# Altium project USB_Isolator.PrjPcb
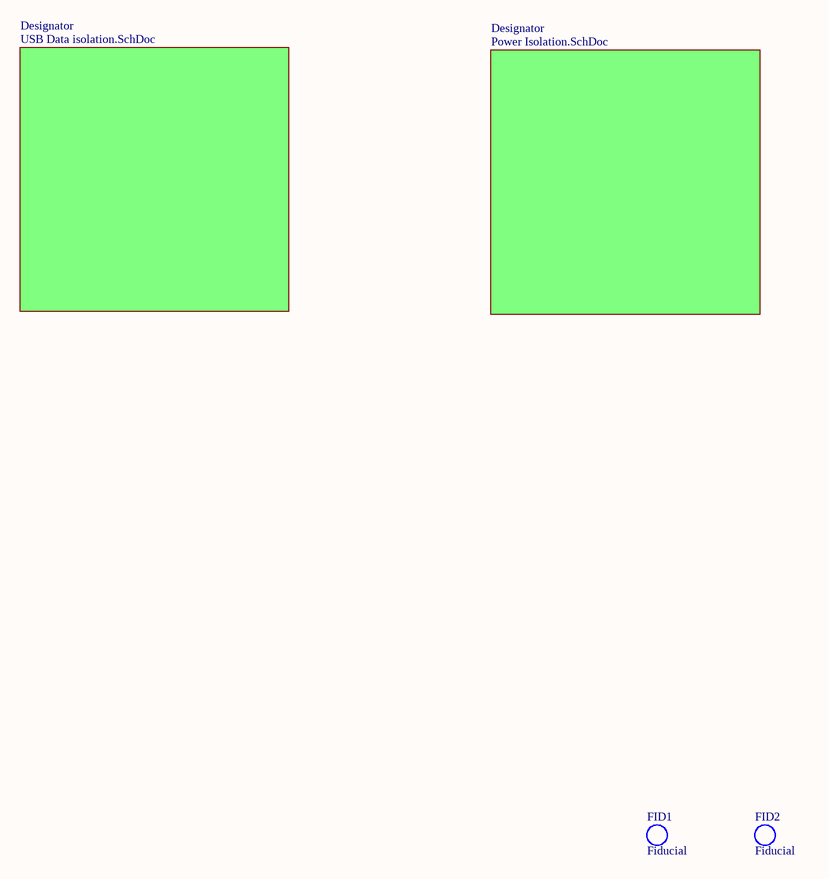
[diagram p0: USB_Isolator.SchDoc]
3 sheets, 26 parts. Net scope: global (net labels, ports and power ports of the same name join across sheets).
Board files: USB Isolator Board.PcbDoc, USB Isolator PNL.PcbDoc
Sheets:
  USB_Isolator.SchDoc
    Designator = USB Data isolation.SchDoc
    Designator = Power Isolation.SchDoc

## Sheet USB_Isolator.SchDoc: USB Isolator by Harsha
size 431 x 279 mm; DrawnBy: Harsha Sandirigama; Engineer: Harsha Sandirigama; DocumentNumber: 1.0; Revision: 1.0; SheetNumber: 1; SheetTotal: 3; Project: USB Isolator; ENG_APP_DATE: --/--/--; DSN_APP_DATE: --/--/--; CHK_APP_DATE: --/--/--

### Parts
FID1  Fiducial  [FID_0.5mm]  (no BOM)
FID2  Fiducial  [FID_0.5mm]  (no BOM)

### Sub-sheets
Designator = USB Data isolation.SchDoc: no entries
Designator = Power Isolation.SchDoc: no entries

### Notes on the sheet
- DWG. NO.
- REV.
- SHT.
- THIS DOCUMENT AND THE DATA DISCLOSED HEREIN OR HEREWITH IS THE PROPERTY OF ALTIUM LIMITED AND MAY BE FREELY DISTRIBUTED IN WHOLE. NO RIGHTS ARE RESERVED OR EXPRESS OR IMPLIED WARANTEE GIVEN.
- REVISION
- DESCRIPTION
- DATE
- APPROVED
- ENG:
- APPROVALS
- PROJECT
- DSN:
- CHK:
- REFERENCE DOCUMENTS
- PROJECT REVISION:
- TITLE
- DOCUMENT REVISION:
- DESIGN ITEM:
- BOM:
- FAB DWG:
- PCB DWG:
- ASSY DWG:
- SCALE:
- SIZE
- B
- CAGE CODE
- FILE NAME
- DWG NO.
- SHEET
- OF
- REV

### Library data of the parts
FID1 FID2 = Fiducial_0.5mm

## Sheet USB Data isolation.SchDoc: USB Data Isolation
size 431 x 279 mm; DrawnBy: Harsha Sandirigama; Engineer: Harsha Sandirigama; Revision: -; SheetNumber: 3; SheetTotal: 3; Project: USB Isolator; ENG_APP_DATE: --/--/--; DSN_APP_DATE: --/--/--; CHK_APP_DATE: --/--/--
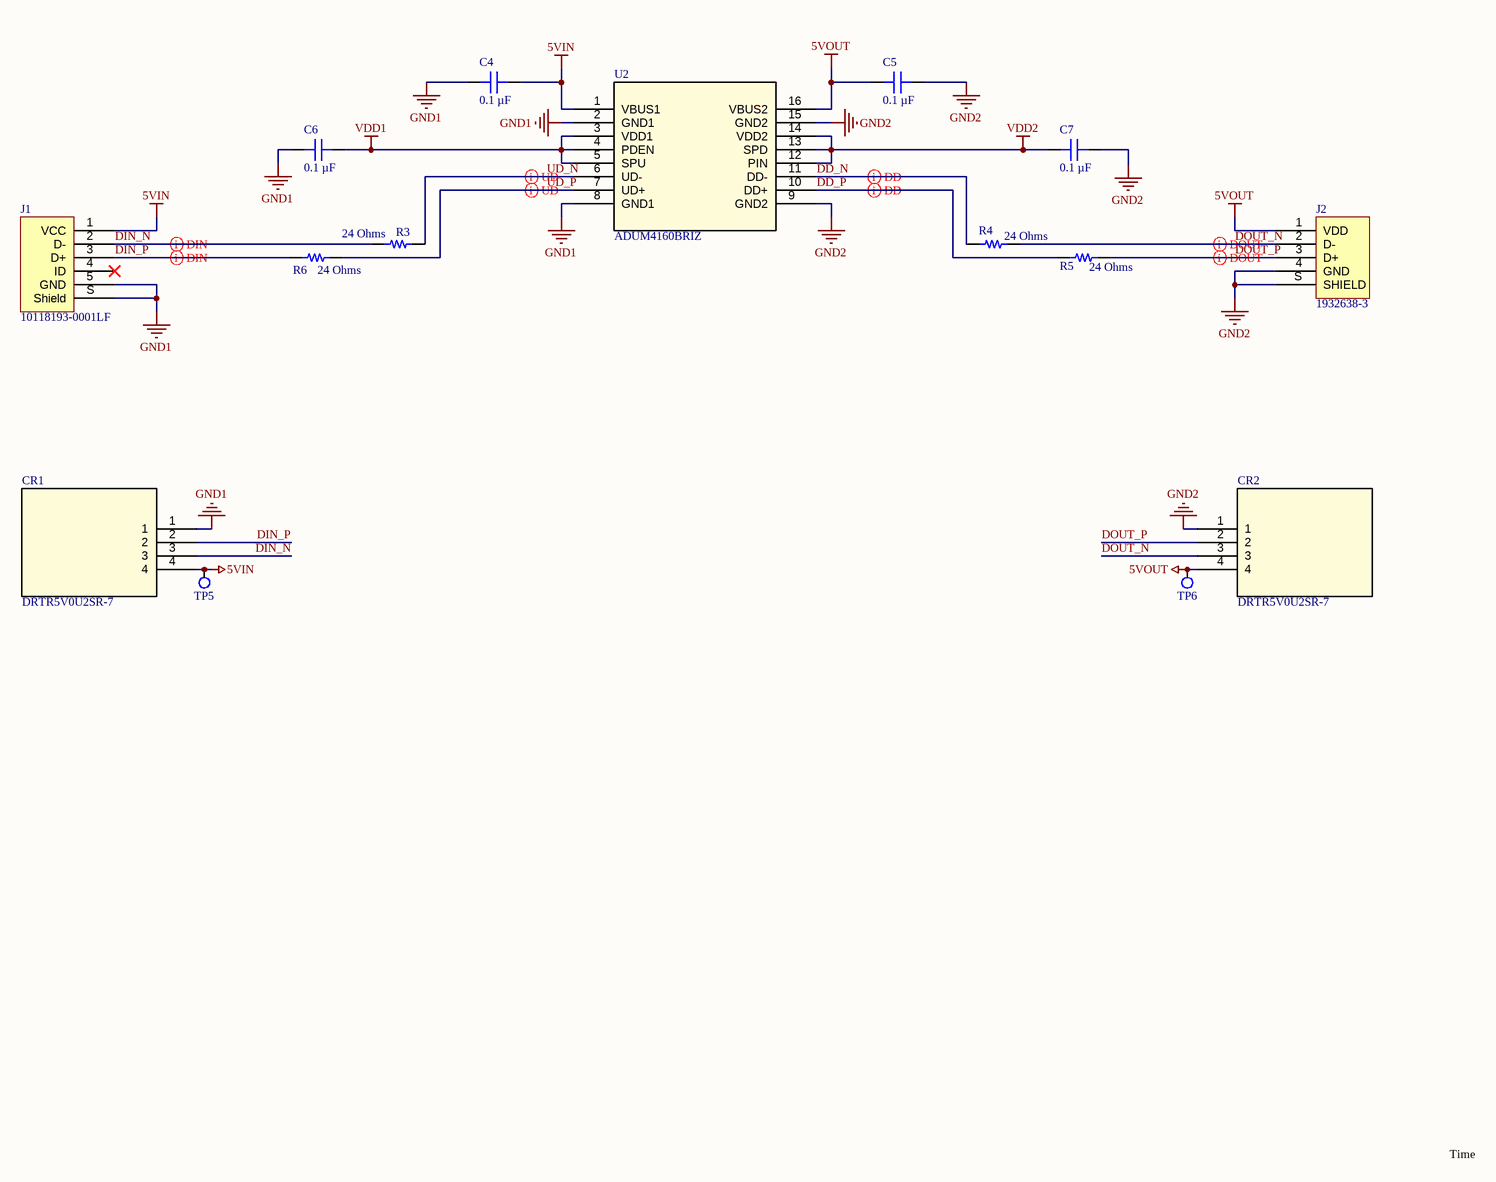
[diagram p1: USB Data isolation.SchDoc]

### Parts
C4  0.1 µF  [CAP 0603_1608]
C5  0.1 µF  [CAP 0603_1608]
C6  0.1 µF  [CAP 0603_1608]
C7  0.1 µF  [CAP 0603_1608]
CR1  DRTR5V0U2SR-7  [SOT143_DIO]
CR2  DRTR5V0U2SR-7  [SOT143_DIO]
J1  10118193-0001LF  [FCI USB 10118193-0001LF]
J2  1932638-3  [TE 1932638-3 USB2.0A]
R3  24 Ohms  [RES 0603_1608]
R4  24 Ohms  [RES 0603_1608]
R5  24 Ohms  [RES 0603_1608]
R6  24 Ohms  [RES 0603_1608]
TP5  Testpoint_1  [Testpoint_1]  (value not drawn)  (no BOM)
TP6  Testpoint_1  [Testpoint_1]  (value not drawn)  (no BOM)
U2  ADUM4160BRIZ  [RI_16_1_ADI]

### Nets
5VIN: C4.1 CR1.4 J1.1(VCC) TP5.1 U2.1(VBUS1)
5VOUT: C5.2 CR2.4 J2.1(VDD) TP6.1 U2.16(VBUS2)
GND1: C4.2 C6.2 CR1.1 J1.5(GND) J1.S(Shield) U2.2(GND1) U2.8(GND1)
GND2: C5.1 C7.1 CR2.1 J2.4(GND) J2.S(SHIELD) U2.9(GND2) U2.15(GND2)
VDD1: C6.1 U2.3(VDD1) U2.4(PDEN) U2.5(SPU)
VDD2: C7.2 U2.12(PIN) U2.13(SPD) U2.14(VDD2)
DD_N: R4.1 U2.11(DD-)
DD_P: R5.1 U2.10(DD+)
DIN_N: CR1.3 J1.2(D-) R3.1
DIN_P: CR1.2 J1.3(D+) R6.1
DOUT_N: CR2.3 J2.2(D-) R4.2
DOUT_P: CR2.2 J2.3(D+) R5.2
UD_N: R3.2 U2.6(UD-)
UD_P: R6.2 U2.7(UD+)

Not connected (* = marked no-connect by the designer): J1 4(ID)*

### Layout directives
differential pair: DD_N, DD_P, DIN_N, DIN_P, DOUT_N, DOUT_P, UD_N, UD_P

### Notes on the sheet
- Time
- DWG. NO.
- REV.
- SHT.
- THIS DOCUMENT AND THE DATA DISCLOSED HEREIN OR HEREWITH IS THE PROPERTY OF ALTIUM LIMITED AND MAY BE FREELY DISTRIBUTED IN WHOLE. NO RIGHTS ARE RESERVED OR EXPRESS OR IMPLIED WARANTEE GIVEN.
- REVISION
- DESCRIPTION
- DATE
- APPROVED
- ENG:
- APPROVALS
- PROJECT
- DSN:
- CHK:
- REFERENCE DOCUMENTS
- PROJECT REVISION:
- TITLE
- DOCUMENT REVISION:
- DESIGN ITEM:
- BOM:
- FAB DWG:
- PCB DWG:
- ASSY DWG:
- SCALE:
- SIZE
- B
- CAGE CODE
- FILE NAME
- DWG NO.
- SHEET
- OF
- REV

### Library data of the parts
C4-C7 = CL10B104KB8NNNL: CAP CER 0.1UF 50V X7R 0603; manufacturer: Samsung Electro-Mechanics; Tolerance: ±10%; Part Number: CL10B104KB8NNNL; Value: 0.1 µF; Applications: General Purpose; Capacitance: 0.1 µF; componentlink1description: Datasheet; componentlink1url: http://www.samsungsem.com/kr/support/product-search/mlcc/CL10B104KB8NNNL.jsp; componentlink2description: DigiKey Link; componentlink2url: https://www.digikey.com/en/products/detail/samsung-electro-mechanics/CL10B104KB8NNNL/3894274; Device Package: 0603 (1608 Metric); lastupdated: 30/03/2022 11:52:00 PM; Lifecycle Status: Active; Minimum Order: 1; Mounting Type: Surface Mount, MLCC; Operating Temperature: -55°C ~ 125°C; Package / Case: 0603 (1608 Metric); packaging: TapeAndReel; partid: 3517; Part Status: Active; price: 0.01; series: CL; Size / Dimension: 0.063" L x 0.031" W (1.60mm x 0.80mm); Supplier 1: DigiKey; Supplier Part Number 1: 1276-CL10B104KB8NNNLCT-ND; Temperature Coefficient: X7R; Thickness (Max): 0.035" (0.90mm); Voltage - Rated: 50V
CR1 CR2 = DRTR5V0U2SR-7: Dual Channel 5.5 V 0.4 W 1 pF Uni-Dirirectional TVS Diode Array - SOT-143; Mfr_Name: Diodes Inc; Manufacturer: Diodes; Type: DEV; Direction: Unidirectional; Number of Bidirectional Channels: 2; Reverse Standoff Voltage: 5.5V; Min Breakdown Voltage: 6V; Power Line Protection: Yes; Peak Pulse Power: 400mW; Test Current: 1mA; Max Reverse Leakage Current: 100nA; Peak Pulse Current: 5A; Copyright: Copyright (C) 2022 Ultra Librarian. All rights reserved.; Manufacturer_Part_Number: DRTR5V0U2SR-7; Digi-Key_Part_Number_1: DRTR5V0U2SR-7DITR-ND; Digi-Key_Part_Number_2: DRTR5V0U2SR-7DICT-ND; Digi-Key_Part_Number_3: DRTR5V0U2SR-7DIDKR-ND; RefDes: RefDes; Supplier 1: Digi-Key; Manufacturer Part Number: DRTR5V0U2SR-7; RoHS: Yes; Category: TVS Diodes; Stock 1: 129137; Pricing 1: 1=0.40000, 10=0.32300, 100=0.22000, 500=0.16500, 1000=0.12375 (USD); Mount: Surface Mount; Case/Package: SOT-143; Number of Pins: 4; Min Operating Temperature: -65°C; Max Operating Temperature: 150°C; Packaging: Tape and Reel; ESD Protection: Yes; Element Configuration: Dual; Length: 3mm; Width: 1.4mm; Height: 1mm; Radiation Hardening: No; RoHS Compliant: Yes; ComponentLink1URL: https://datasheet.ciiva.com/29588/drtr5v0u2sr-29588600.pdf?src-supplier=Digi-Key; ComponentLink1Description: https://datasheet.ciiva.com/29588/drtr5v0u2sr-29588600.pdf?src-supplier=Digi-Key; ComponentLink2URL: https://datasheet.ciiva.com/48480/drtr5v0u2sr-48480031.pdf?src-supplier=Avnet; ComponentLink2Description: https://datasheet.ciiva.com/48480/drtr5v0u2sr-48480031.pdf?src-supplier=Avnet; ComponentLink3URL: https://datasheet.ciiva.com/29588/drtr5v0u2sr-29588602.pdf?src-supplier=Digi-Key; ComponentLink3Description: https://datasheet.ciiva.com/29588/drtr5v0u2sr-29588602.pdf?src-supplier=Digi-Key; Supplier Part Number 1: DRTR5V0U2SR-7DICT-ND
J1 = 10118193-0001LF: CONN RCPT USB2.0 MICRO B SMD R/A; Manufacturer: Amphenol ICC (FCI); Connector Type: USB - micro B; Current Rating (Amps): 1.8A per Contact; Gender: Receptacle; Mating Cycles: 10000; Number of Contacts: 5; Number of Ports: 1; Shielding: Shielded; Voltage - Rated: 100VAC; Part Number: 10118193-0001LF; ComponentLink1Description: Datasheet; ComponentLink1URL: https://cdn.amphenol-icc.com/media/wysiwyg/files/documentation/datasheet/inputoutput/io_usb_micro.pdf; ComponentLink2Description: DigiKey Link; ComponentLink2URL: //digikey.com/product-detail/en/amphenol-icc-fci/10118193-0001LF/609-4616-2-ND/2785388; Features: Solder Retention; LastUpdated: 9/12/2019 8:51:28 PM; Lifecycle Status: 0; Minimum Order: 1; Mounting Feature: Horizontal; Mounting Type: Surface Mount, Right Angle; Through Hole; Operating Temperature: -30°C ~ 80°C; Packaging: TapeAndReel; Part Status: Active; Price: 0.21; Series: -; Specifications: USB 2.0; Supplier 1: DigiKey; Supplier Part Number 1: 609-4616-2-ND; Termination: Solder
J2 = 1932638-3: CONN RCPT USB2.0 TYPEA 4P SMD RA; Manufacturer: TE Connectivity AMP Connectors; Connector Type: USB - A; Current Rating (Amps): 1A per Contact; Gender: Receptacle; Mating Cycles: 1500; Number of Contacts: 4; Number of Ports: 1; Shielding: Shielded; Voltage - Rated: 30VAC; Part Number: 1932638-3; ComponentLink1Description: Datasheet; ComponentLink1URL: https://www.te.com/commerce/DocumentDelivery/DDEController?Action=srchrtrv&DocNm=501-60007-1&DocType=SS&DocLang=EN; ComponentLink2Description: DigiKey Link; ComponentLink2URL: //digikey.com/product-detail/en/te-connectivity-amp-connectors/1932638-3/A117902TR-ND/4731612; Features: Solder Retention; LastUpdated: 9/12/2019 8:47:08 PM; Lifecycle Status: 0; Minimum Order: 1; Mounting Feature: Horizontal; Mounting Type: Surface Mount, Right Angle; Operating Temperature: -55°C ~ 85°C; Packaging: TapeAndReel; Part Status: Active; Price: 0.97; Series: -; Specifications: USB 2.0; Supplier 1: DigiKey; Supplier Part Number 1: A117902TR-ND; Termination: Solder
R3-R6 = CPF0603B24RE1: RES SMD 24 OHM 0.1% 1/16W 0603; Manufacturer: TE Connectivity Passive Product; Power (Watts): 0.063W, 1/16W; Temperature Coefficient: ±25ppm/°C; Part Number: CPF0603B24RE1; Value: 24 Ohms; ComponentLink1Description: Datasheet; ComponentLink1URL: https://www.te.com/commerce/DocumentDelivery/DDEController?Action=srchrtrv&DocNm=1773200&DocType=DS&DocLang=English; ComponentLink2Description: DigiKey Link; ComponentLink2URL: https://www.digikey.com/en/products/detail/te-connectivity-passive-product/CPF0603B24RE1/2381882; Composition: Thin Film; Device Package: 0603 (1608 Metric); Height - Seated (Max): 0.022" (0.55mm); LastUpdated: 31/03/2022 9:04:55 AM; Lifecycle Status: Active; Minimum Order: 1; Number of Terminations: 2; Operating Temperature: -55°C ~ 155°C; Package / Case: 0603 (1608 Metric); Packaging: TapeAndReel; PartId: 5768; Part Status: Active; Price: 0.13; Resistance: 24 Ohms; Series: CPF, Neohm; Size / Dimension: 0.061" L x 0.031" W (1.55mm x 0.80mm); Supplier 1: DigiKey; Supplier Part Number 1: A103071CT-ND; Supplier Device Package: 0603; Tolerance: ±0.1%
TP5 TP6 = Testpoint_1: Testpoint
U2 = ADUM4160BRIZ: USB Digital Isolator 5000Vrms 1 Channel 12Mbps 25kV/µs CMTI 16-SOIC (0.295", 7.50mm Width); Mfr_Name: Analog Devices Inc; Copyright: Copyright (C) 2022 Ultra Librarian. All rights reserved.; Manufacturer_Part_Number: ADUM4160BRIZ; RefDes: RefDes; Type: DEV

## Sheet Power Isolation.SchDoc: Power Isolation
size 431 x 279 mm; Engineer: Harsha Sandirigama; Revision: -; SheetNumber: 2; SheetTotal: 3; Project: USB Isolator; ENG_APP_DATE: --/--/--; DSN_APP_DATE: --/--/--; CHK_APP_DATE: --/--/--
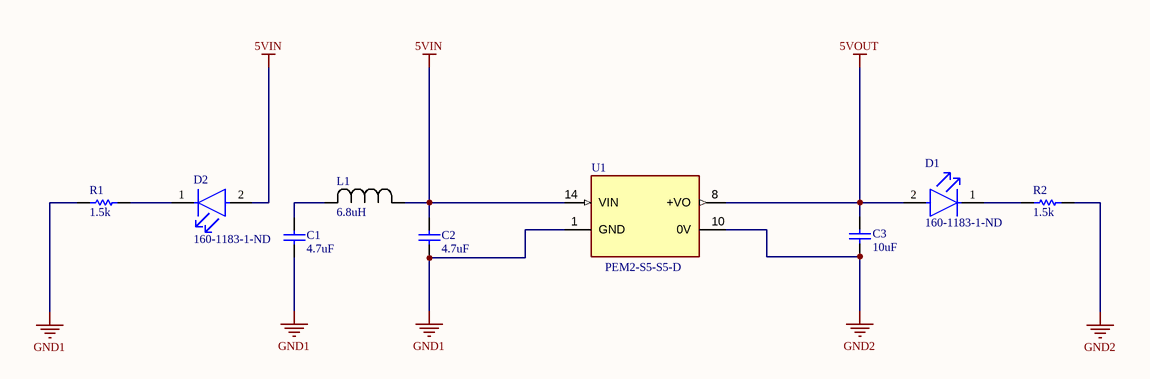
[diagram p2: Power Isolation.SchDoc]

### Parts
C1  4.7uF  [1206C]
C2  4.7uF  [1206C]
C3  10uF  [1206C]
D1  Supplier Part Number 1: 160-1183-1-ND  [Lite-On_0_MFG]  (hidden comment: LED)
D2  Supplier Part Number 1: 160-1183-1-ND  [Lite-On_0_MFG]  (hidden comment: LED)
L1  6.8uH  [IND_TAIYO_LBC3225_TAY]
R1  1.5k  [0805R]
R2  1.5k  [0805R]
U1  PEM2-S5-S5-D  [CONV_PEM2-S5-S5-D]

### Nets
5VIN: C2.2 D2.2(A) L1.1 U1.14(VIN)
5VOUT: C3.2 D1.2(A) U1.8(+VO)
GND1: C1.1 C2.1 R1.1 U1.1(GND)
GND2: C3.1 R2.2 U1.10(0V)
NetC1_2: C1.2 L1.2
NetD1_1: D1.1(C) R2.1
NetD2_1: D2.1(C) R1.2

### Notes on the sheet
- DWG. NO.
- REV.
- SHT.
- THIS DOCUMENT AND THE DATA DISCLOSED HEREIN OR HEREWITH IS THE PROPERTY OF ALTIUM LIMITED AND MAY BE FREELY DISTRIBUTED IN WHOLE. NO RIGHTS ARE RESERVED OR EXPRESS OR IMPLIED WARANTEE GIVEN.
- REVISION
- DESCRIPTION
- DATE
- APPROVED
- ENG:
- APPROVALS
- PROJECT
- DSN:
- CHK:
- REFERENCE DOCUMENTS
- PROJECT REVISION:
- TITLE
- DOCUMENT REVISION:
- DESIGN ITEM:
- BOM:
- FAB DWG:
- PCB DWG:
- ASSY DWG:
- SCALE:
- SIZE
- B
- CAGE CODE
- FILE NAME
- DWG NO.
- SHEET
- OF
- REV

### Library data of the parts
C1 C2 = GRM31CR71H475KA12L: CAP CER 4.7UF 50V X7R 1206; Manufacturer: Murata; Material: Ceramic; Tolerance: 10%; Supplier 1: Digi-Key; Manufacturer Part Number: GRM31CR71H475KA12L; RoHS: Yes; Category: Ceramic Capacitors; Stock 1: 866926; Pricing 1: 1=0.44000, 10=0.30200, 50=0.21180, 100=0.18150, 500=0.13612, 1000=0.11495 (USD); Mount: Surface Mount; Case/Package: 1206; Case Code (Metric): 3216; Case Code (Imperial): 1206; Min Operating Temperature: -55°C; Max Operating Temperature: 125°C; Capacitance: 4.7uF; Packaging: Tape and Reel; Voltage Rating (DC): 50V; Package Quantity: 2000; Voltage Rating: 50V; Dielectric: X7R; Voltage: 50V; Termination: SMD/SMT; Series: GRM; Construction: Flat; Length: 3.2mm; Width: 0.063inch; Height: 1.6mm; Depth: 1.6mm; Thickness: 0.071inch; Radiation Hardening: No; REACH SVHC: No SVHC; Lead Free: Lead Free; RoHS Compliant: Yes; ComponentLink1URL: https://datasheet.ciiva.com/6072/415379-6072784.pdf?src-supplier=Farnell; ComponentLink1Description: https://datasheet.ciiva.com/6072/415379-6072784.pdf?src-supplier=Farnell; ComponentLink2URL: https://datasheet.ciiva.com/3777/2267grm31cr71h475ka1223-3777241.pdf?src-supplier=Arrow+Electronics; ComponentLink2Description: https://datasheet.ciiva.com/3777/2267grm31cr71h475ka1223-3777241.pdf?src-supplier=Arrow+Electronics; ComponentLink3URL: https://datasheet.ciiva.com/29202/450972-da-01-de-vs-chip-kond-1206-4-7-uf-10pr-50-0v-x7r-29202576.pdf?src-supplier=Conrad; ComponentLink3Description: https://datasheet.ciiva.com/29202/450972-da-01-de-vs-chip-kond-1206-4-7-uf-10pr-50-0v-x7r-29202576.pdf?src-supplier=Conrad; ComponentLink4URL: https://datasheet.ciiva.com/29202/451279-da-01-de-vs-kondens-grm31-cr71h-475ka12l-29202365.pdf?src-supplier=Conrad; ComponentLink4Description: https://datasheet.ciiva.com/29202/451279-da-01-de-vs-kondens-grm31-cr71h-475ka12l-29202365.pdf?src-supplier=Conrad; ComponentLink5URL: https://datasheet.ciiva.com/7937/415310-7937749.pdf?src-supplier=Element14; ComponentLink5Description: https://datasheet.ciiva.com/7937/415310-7937749.pdf?src-supplier=Element14; ComponentLink6URL: https://datasheet.ciiva.com/6270/partnumbering-e-01-6270218.pdf?src-supplier=Digi-Key; ComponentLink6Description: https://datasheet.ciiva.com/6270/partnumbering-e-01-6270218.pdf?src-supplier=Digi-Key; ComponentLink7URL: https://datasheet.ciiva.com/6270/partnumbering-e-01-6270217.pdf?src-supplier=Digi-Key; ComponentLink7Description: https://datasheet.ciiva.com/6270/partnumbering-e-01-6270217.pdf?src-supplier=Digi-Key; ComponentLink8URL: https://datasheet.ciiva.com/6270/partnumbering-e-01-6270219.pdf?src-supplier=Digi-Key; ComponentLink8Description: https://datasheet.ciiva.com/6270/partnumbering-e-01-6270219.pdf?src-supplier=Digi-Key; Supplier Part Number 1: 490-6521-1-ND
C3 = TMK316BJ106ML-T: Capacitor 10uF ±20% 25V 1206; Manufacturer: Taiyo Yuden; Tolerance: 10%; Dielectric: X5R; Supplier 1: Digi-Key; Manufacturer Part Number: TMK316BJ106ML-T; RoHS: Yes; Category: Ceramic Capacitors; Stock 1: 411339; Pricing 1: 1=0.28000, 10=0.18900, 50=0.12600, 100=0.10710, 500=0.07562, 1000=0.06617 (USD); Mount: Surface Mount; Case/Package: 1206; Number of Pins: 2; Case Code (Imperial): 1206; Case Code (Metric): 3216; Contact Plating: Nickel; Min Operating Temperature: -55°C; Max Operating Temperature: 85°C; Capacitance: 10uF; Packaging: Tape and Reel; Voltage Rating: 25V; Package Quantity: 1; Voltage Rating (DC): 25V; Termination: SMD/SMT; Voltage: 25V; Series: M; Construction: Flat; Resistor Type: Ceramic; Length: 3.2mm; Width: 1.6mm; Height: 1.6mm; Depth: 1.6mm; Thickness: 0.071inch; Radiation Hardening: No; REACH SVHC: Unknown; RoHS Compliant: Yes; Lead Free: Lead Free; Halogen Free: Halogen Free; ComponentLink1URL: https://datasheet.ciiva.com/137/tmk316bj106ml-t-ss-137881.pdf?src-supplier=Digi-Key; ComponentLink1Description: https://datasheet.ciiva.com/137/tmk316bj106ml-t-ss-137881.pdf?src-supplier=Digi-Key; ComponentLink2URL: https://datasheet.ciiva.com/11601/tmk316bj106ml-t-ss-11601883.pdf?src-supplier=Avnet; ComponentLink2Description: https://datasheet.ciiva.com/11601/tmk316bj106ml-t-ss-11601883.pdf?src-supplier=Avnet; ComponentLink3URL: https://datasheet.ciiva.com/15922/1117tmk316bj106ml-t-15922416.pdf?src-supplier=Onlinecomponents.com; ComponentLink3Description: https://datasheet.ciiva.com/15922/1117tmk316bj106ml-t-15922416.pdf?src-supplier=Onlinecomponents.com; ComponentLink4URL: https://datasheet.ciiva.com/30087/617tmk316bj106ml-t-30087946.pdf?src-supplier=Onlinecomponents.com; ComponentLink4Description: https://datasheet.ciiva.com/30087/617tmk316bj106ml-t-30087946.pdf?src-supplier=Onlinecomponents.com; ComponentLink5URL: https://datasheet.ciiva.com/7975/1481447-7975845.pdf?src-supplier=Element14; ComponentLink5Description: https://datasheet.ciiva.com/7975/1481447-7975845.pdf?src-supplier=Element14; ComponentLink6URL: https://datasheet.ciiva.com/7975/1481447-7975597.pdf?src-supplier=Element14; ComponentLink6Description: https://datasheet.ciiva.com/7975/1481447-7975597.pdf?src-supplier=Element14; ComponentLink7URL: https://datasheet.ciiva.com/28645/746258-28645286.pdf?src-supplier=Element14; ComponentLink7Description: https://datasheet.ciiva.com/28645/746258-28645286.pdf?src-supplier=Element14
D1 D2 = LTST-C190GKT: LED 0603(H=0.9mm) λD=569nm VR=5V VF=2.1V~2.6V IF=20mA PD=100mW; Manufacturer: Vishay Lite-On; Color: Green; Lens Color: Colorless; Luminous Intensity: 6mcd; Forward Voltage: 2.1V; Viewing Angle: 130°; Lens Style: Clear,Diffused,Colorless,Rectangular; Forward Current: 30mA; Dominant Wavelength: 569nm; Test Current: 10mA; Number of Elements: 1; Power Dissipation: 100mW; Wavelength: 565nm; Reverse Voltage: 5V; Lens Transparency: Clear; Voltage: 2V; Supplier 1: Digi-Key; Manufacturer Part Number: LTST-C190GKT; RoHS: Yes; Category: LEDs; Stock 1: 553647; Pricing 1: 1=0.24000, 10=0.13200, 100=0.06110, 500=0.05640, 1000=0.04418, 2000=0.04324 (USD); Mount: Surface Mount; Case/Package: 0603; Number of Pins: 2; Case Code (Metric): 1608; Case Code (Imperial): 0603; Min Operating Temperature: -55°C; Max Operating Temperature: 85°C; Package Quantity: 1; Packaging: Tape and Reel; Illumination Color: Green; Number of LEDs: 1; Power Rating: 100mW; Length: 1.6mm; Width: 0.8mm; Height: 0.8mm; Depth: 0.8mm; Radiation Hardening: No; RoHS Compliant: Yes; Lead Free: Lead Free; ComponentLink1URL: https://datasheet.ciiva.com/2109/ltst-c190gkt-2109985.pdf?src-supplier=Digi-Key; ComponentLink1Description: https://datasheet.ciiva.com/2109/ltst-c190gkt-2109985.pdf?src-supplier=Digi-Key; ComponentLink2URL: https://datasheet.ciiva.com/11775/0900766b80dc02a6-11775616.pdf?src-supplier=RSComponents; ComponentLink2Description: https://datasheet.ciiva.com/11775/0900766b80dc02a6-11775616.pdf?src-supplier=RSComponents; ComponentLink3URL: https://datasheet.ciiva.com/12403/lite-on-ltst-c190gkt-187204-12403884.pdf?src-supplier=Mouser; ComponentLink3Description: https://datasheet.ciiva.com/12403/lite-on-ltst-c190gkt-187204-12403884.pdf?src-supplier=Mouser; ComponentLink4URL: https://datasheet.ciiva.com/16392/lite-on20ltst-c190gkt-16392818.pdf?src-supplier=Future+Electronics; ComponentLink4Description: https://datasheet.ciiva.com/16392/lite-on20ltst-c190gkt-16392818.pdf?src-supplier=Future+Electronics; ComponentLink5URL: https://datasheet.ciiva.com/2109/ltst-c190gkt-2109986.pdf?src-supplier=Digi-Key; ComponentLink5Description: https://datasheet.ciiva.com/2109/ltst-c190gkt-2109986.pdf?src-supplier=Digi-Key; ComponentLink6URL: https://datasheet.ciiva.com/2109/ltst-c190gkt-2109987.pdf?src-supplier=Digi-Key; ComponentLink6Description: https://datasheet.ciiva.com/2109/ltst-c190gkt-2109987.pdf?src-supplier=Digi-Key
L1 = LBC3225T6R8MR_1: Inductor General Purpose Chip Wirewound 6.8uH 20% 100KHz Ferrite 0.62A 0.156Ohm DCR 1210 T/R; Mfr_Name: Taiyo Yuden; Type: DEV; Self Resonant Frequency: 50MHz; Current Rating: 620mA; Shielding: Unshielded; DC Resistance (DCR): 120mR; Copyright: Copyright (C) 2022 Ultra Librarian. All rights reserved.; Manufacturer_Part_Number: LBC3225T6R8MR; RefDes: RefDes; Supplier 1: Digi-Key; Manufacturer: Taiyo Yuden; Manufacturer Part Number: LBC3225T6R8MR; RoHS: Yes; Category: Fixed Inductors; Stock 1: 24416; Pricing 1: 1=0.20000, 10=0.17800, 25=0.15840, 50=0.13460, 100=0.11880, 250=0.10888, 500=0.09900 (USD); Mount: Surface Mount; Case/Package: 1210; Number of Pins: 2; Core Material: Ferrite; Case Code (Metric): 3225; Case Code (Imperial): 1210; Min Operating Temperature: -40°C; Max Operating Temperature: 105°C; Packaging: Tape and Reel; Package Quantity: 1000; Inductance: 6.8uH; Test Frequency: 100kHz; Series: LB; Tolerance: 20%; Max DC Current: 620mA; Termination: SMD/SMT; Resistor Type: Wirewound; Inductance Tolerance: 20%; Length: 0.126inch; Width: 2.5mm; Height: 2.5mm; Height - Seated (Max): 0.106inch; Depth: 2.7mm; Lead Pitch: 2.7mm; Radiation Hardening: No; REACH SVHC: Unknown; Lead Free: Lead Free; Halogen Free: Halogen Free; ComponentLink1URL: https://datasheet.ciiva.com/8503/lbc3225t6r8mr-ss-8503074.pdf?src-supplier=Avnet; ComponentLink1Description: https://datasheet.ciiva.com/8503/lbc3225t6r8mr-ss-8503074.pdf?src-supplier=Avnet; Supplier Part Number 1: 587-2433-1-ND
R1 R2 = CRCW08051K50FKEA: Res Thick Film 0805 1.5K Ohm 1% 1/8W ±100ppm/°C Molded SMD Paper T/R; Manufacturer: Vishay; Voltage Rating: 150V; Resistance: 1.5kR; Power Rating: 125mW; Supplier 1: RSComponents; Manufacturer Part Number: CRCW08051K50FKEA; RoHS: Yes; Category: Chip SMD Resistors; Stock 1: 1; Pricing 1: 50=0.09800, 500=0.09100, 1000=0.08200, 2000=0.07300, 4000=0.06500 (USD); Case/Package: 0805; Case Code (Metric): 2012; Case Code (Imperial): 0805; Contact Plating: Tin; Weight: 0.000194oz; Size Code: 0805; Min Operating Temperature: -55°C; Max Operating Temperature: 155°C; Package Quantity: 10; Series: CRCW; Packaging: Tape and Reel; Termination: SMD/SMT; Temperature Coefficient: 100ppm/°C; Voltage Rating (DC): 150V; Construction: Rectangular; Tolerance: 1%; Resistor Type: Thick Film; Number of Terminations: 2; Max Power Dissipation: 125mW; Features: Automotive AEC-Q200; Resistance Tolerance: 1%; Technology: THICK FILM; Length: 2mm; Width: 0.049inch; Height: 0.45mm; Depth: 1.25mm; Radiation Hardening: No; RoHS Compliant: Yes; REACH SVHC: Unknown; Lead Free: Lead Free; Military Standard: Not; ComponentLink1URL: https://datasheet.ciiva.com/11809/0900766b80d98b26-11809039.pdf?src-supplier=RSComponents; ComponentLink1Description: https://datasheet.ciiva.com/11809/0900766b80d98b26-11809039.pdf?src-supplier=RSComponents; ComponentLink2URL: https://datasheet.ciiva.com/2467/dcrcwe3-2467186.pdf?src-supplier=Digi-Key; ComponentLink2Description: https://datasheet.ciiva.com/2467/dcrcwe3-2467186.pdf?src-supplier=Digi-Key; ComponentLink3URL: https://datasheet.ciiva.com/3258/dcrcwe3-3258255.pdf?src-supplier=Avnet; ComponentLink3Description: https://datasheet.ciiva.com/3258/dcrcwe3-3258255.pdf?src-supplier=Avnet; ComponentLink4URL: https://datasheet.ciiva.com/2467/dcrcwe3-2467185.pdf?src-supplier=Digi-Key; ComponentLink4Description: https://datasheet.ciiva.com/2467/dcrcwe3-2467185.pdf?src-supplier=Digi-Key; ComponentLink5URL: https://datasheet.ciiva.com/2467/dcrcwe3-2467187.pdf?src-supplier=Digi-Key; ComponentLink5Description: https://datasheet.ciiva.com/2467/dcrcwe3-2467187.pdf?src-supplier=Digi-Key; ComponentLink6URL: https://datasheet.ciiva.com/16291/dcrcwe3-16291272.pdf?src-supplier=Future+Electronics; ComponentLink6Description: https://datasheet.ciiva.com/16291/dcrcwe3-16291272.pdf?src-supplier=Future+Electronics; ComponentLink7URL: https://datasheet.ciiva.com/7777/1697337-7777375.pdf?src-supplier=Element14; ComponentLink7Description: https://datasheet.ciiva.com/7777/1697337-7777375.pdf?src-supplier=Element14; ComponentLink8URL: https://datasheet.ciiva.com/7777/1720486-7777609.pdf?src-supplier=Element14; ComponentLink8Description: https://datasheet.ciiva.com/7777/1720486-7777609.pdf?src-supplier=Element14; ComponentLink9URL: https://datasheet.ciiva.com/16778/70201119-16778857.pdf?src-supplier=Allied+Electronics; ComponentLink9Description: https://datasheet.ciiva.com/16778/70201119-16778857.pdf?src-supplier=Allied+Electronics; ComponentLink10URL: https://datasheet.ciiva.com/26312/fld-crcw-e3-data-en-26312926.pdf?src-supplier=Distrelec; ComponentLink10Description: https://datasheet.ciiva.com/26312/fld-crcw-e3-data-en-26312926.pdf?src-supplier=Distrelec; Supplier Part Number 1: 6791014; Supplier 2: Digi-Key; Pricing 2: 1=0.10000, 10=0.06700, 100=0.02710, 1000=0.01219, 2500=0.01058 (USD); Supplier Part Number 2: 541-1.50KCDKR-ND
U1 = PEM2-S5-S5-D: 2 W, 5 V, 400 mA, Single Unregulated Output, Isolated Dc-Dc converter; Manufacturer: CUI; Number of Outputs: 1; Efficiency: 85%; Min Input Voltage: 4.5V; Max Input Voltage: 5.5V; Voltage - Output 1: 5V; Max Output Current: 400mA; Isolation Voltage: 3kV; Max Power Dissipation: 2W; Package: None; Price: None; Value: *; Availability: Unavailable; Supplier 1: Digi-Key; Manufacturer Part Number: PEM2-S5-S5-D; RoHS: Yes; Category: Voltage Regulators - Switching; Stock 1: 242; Pricing 1: 1=8.33000, 5=8.21200, 10=8.09200, 25=7.85400, 50=7.61600, 100=7.37800, 250=7.14000, 450=6.66400 (USD); Mount: Through Hole; Case/Package: DIP; Weight: 0.084658oz; Min Operating Temperature: -40°C; Max Operating Temperature: 105°C; Package Quantity: 25; Packaging: Bulk; Output Power: 2W; Current - Output 1: 400mA; Features: SCP; Length: 20mm; Width: 10mm; Height: 0.32inch; Lead Free: Lead Free; ComponentLink1URL: http://www.mouser.com/ds/2/670/pem2-d-1079633.pdf?src-supplier=Mouser; ComponentLink1Description: http://www.mouser.com/ds/2/670/pem2-d-1079633.pdf?src-supplier=Mouser; ComponentLink2URL: https://www.cui.com/product/resource/digikeypdf/pem2-d.pdf?src-supplier=Digi-Key; ComponentLink2Description: https://www.cui.com/product/resource/digikeypdf/pem2-d.pdf?src-supplier=Digi-Key; ComponentLink3URL: http://www.cui.com/product/resource/digikeypdf/pem2-d.pdf?src-supplier=Digi-Key; ComponentLink3Description: http://www.cui.com/product/resource/digikeypdf/pem2-d.pdf?src-supplier=Digi-Key; Supplier Part Number 1: 102-4560-ND; RoHS Compliant: Yes; MP: PEM2-S5-S5-D

## Nets that join several sheets
5VIN: USB Data isolation (5 pins), Power Isolation (C2.2 D2.2 L1.1 U1.14)
5VOUT: USB Data isolation (5 pins), Power Isolation (C3.2 D1.2 U1.8)
GND1: USB Data isolation (7 pins), Power Isolation (C1.1 C2.1 R1.1 U1.1)
GND2: USB Data isolation (7 pins), Power Isolation (C3.1 R2.2 U1.10)